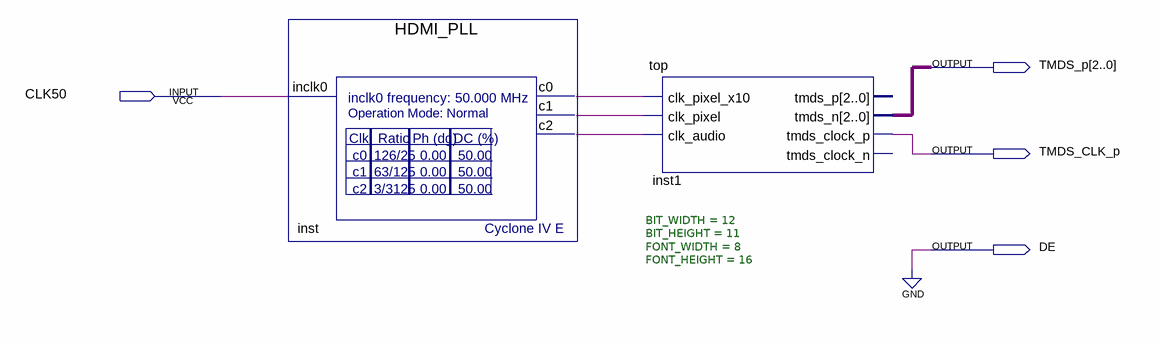
[diagram p0: schematic sheet]
// Quartus schematic HDMI_test.bdf as structural Verilog: 2 symbols, 4 pins
module HDMI_test (
  input  CLK50,
  output [2:0] TMDS_p,
  output TMDS_CLK_p,
  output DE
);

  wire inst_c0, inst_c1, inst_c2;

  HDMI_PLL inst (.inclk0(CLK50), .c0(inst_c0), .c1(inst_c1), .c2(inst_c2));
  top #(.BIT_WIDTH(12), .BIT_HEIGHT(11), .FONT_WIDTH(8), .FONT_HEIGHT(16)) inst1 (
    .clk_pixel_x10(inst_c0), .clk_pixel(inst_c1), .clk_audio(inst_c2), .tmds_n(TMDS_p),
    .tmds_clock_p(TMDS_CLK_p));  // open: tmds_p, tmds_clock_n

  assign DE = 1'b0;
endmodule
